# Altium schematic sheet DAC_8CH.SchDoc
size A4; DocumentNumber: 3; SheetNumber: 3; SheetTotal: 7
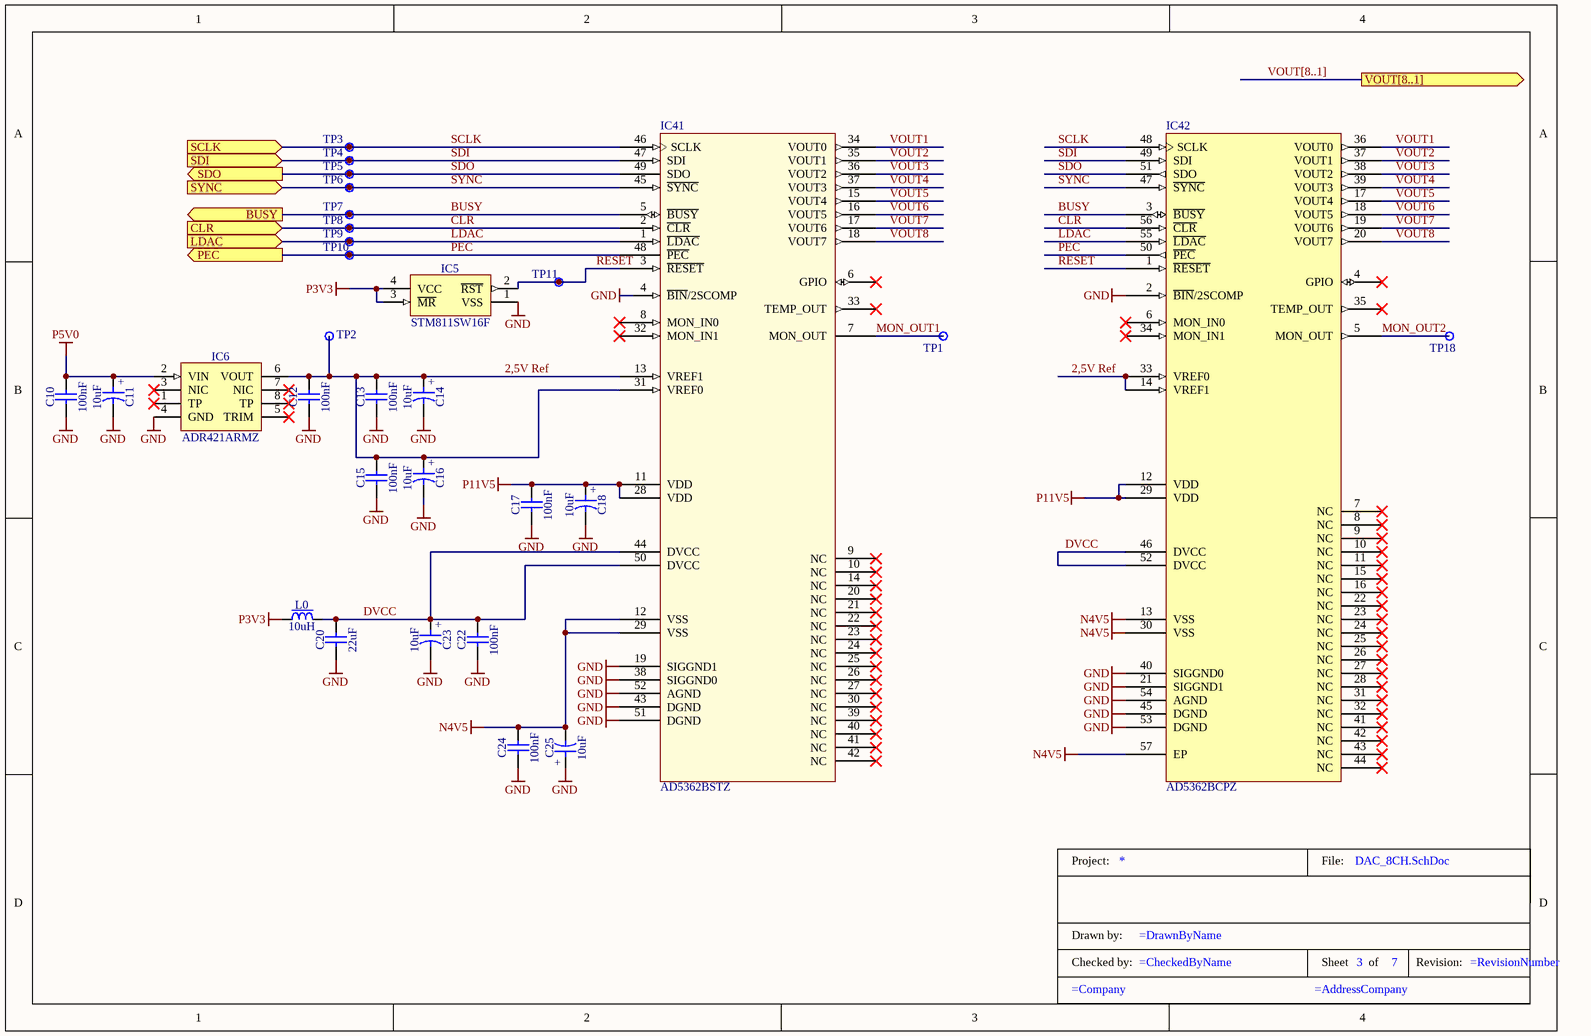
[diagram p0: DAC_8CH.SchDoc]

## Parts
C10  100nF  [CAPC1005X55N]
C11  10uF  [CAPMP3528X210N]
C12  100nF  [CAPC1005X55N]
C13  100nF  [CAPC1005X55N]
C14  10uF  [CAPMP3528X210N]
C15  100nF  [CAPC1005X55N]
C16  10uF  [CAPMP3528X210N]
C17  100nF  [CAPC1005X55N]
C18  10uF  [CAPMP3528X210N]
C20  22uF  [CAPC2012X135N]
C22  100nF  [CAPC1005X55N]
C23  10uF  [CAPMP3528X210N]
C24  100nF  [CAPC1005X55N]
C25  10uF  [CAPMP3528X210N]
IC5  STM811SW16F  [SOT143N]
IC6  ADR421ARMZ  [SOP65P490X110-8N]
IC41  AD5362BSTZ  [ST-52_N]
IC42  AD5362BCPZ  [CP-56-1_N]
L0  10uH  [IND_MURATA-PS_8400]
TitleBlock3  TitleBlock  (value not drawn)  (graphical)
TP1  Test Point  [TPS127]  (value not drawn)
TP2  Test Point  [TPS127]  (value not drawn)
TP3  Test Point  [TPS127]  (value not drawn)
TP4  Test Point  [TPS127]  (value not drawn)
TP5  Test Point  [TPS127]  (value not drawn)
TP6  Test Point  [TPS127]  (value not drawn)
TP7  Test Point  [TPS127]  (value not drawn)
TP8  Test Point  [TPS127]  (value not drawn)
TP9  Test Point  [TPS127]  (value not drawn)
TP10  Test Point  [TPS127]  (value not drawn)
TP11  Test Point  [TPS127]  (value not drawn)
TP18  Test Point  [TPS127]  (value not drawn)

## Ports
BUSY (out), CLR (in), LDAC (in), PEC (out), SCLK (in), SDI (in), SDO (out), SYNC (in), VOUT[8..1] (out)

## Nets
GND: C10.1 C11.2 C12.1 C13.1 C14.2 C15.1 C16.2 C17.1 C18.2 C20.1 C22.1 C23.2 C24.1 C25.1 IC5.1(VSS) IC6.4(GND) IC41.4(~{BIN}/2SCOMP) IC41.19(SIGGND1) IC41.38(SIGGND0) IC41.43(DGND) IC41.51(DGND) IC41.52(AGND) IC42.2(~{BIN}/2SCOMP) IC42.21(SIGGND1) IC42.40(SIGGND0) IC42.45(DGND) IC42.53(DGND) IC42.54(AGND)
N4V5: C24.2 C25.2 IC41.12(VSS) IC41.29(VSS) IC42.13(VSS) IC42.30(VSS) IC42.57(EP)
P3V3: IC5.3(~{MR}) IC5.4(VCC) L0.1
P5V0: C10.2 C11.1 IC6.2(VIN)
P11V5: C17.2 C18.1 IC41.11(VDD) IC41.28(VDD) IC42.12(VDD) IC42.29(VDD)
2,5V Ref: C12.2 C13.2 C14.1 C15.2 C16.1 IC6.6(VOUT) IC41.13(VREF1) IC41.31(VREF0) IC42.14(VREF1) IC42.33(VREF0) TP2.1
BUSY: IC41.5(~{BUSY}) IC42.3(~{BUSY}) TP7.1 ; port BUSY
CLR: IC41.2(~{CLR}) IC42.56(~{CLR}) TP8.1 ; port CLR
DVCC: C20.2 C22.2 C23.1 IC41.44(DVCC) IC41.50(DVCC) IC42.46(DVCC) IC42.52(DVCC) L0.2
LDAC: IC41.1(~{LDAC}) IC42.55(~{LDAC}) TP9.1 ; port LDAC
MON_OUT1: IC41.7(MON_OUT) TP1.1
MON_OUT2: IC42.5(MON_OUT) TP18.1
PEC: IC41.48(~{PEC}) IC42.50(~{PEC}) TP10.1 ; port PEC
~{RESET}: IC5.2(~{RST}) IC41.3(~{RESET}) IC42.1(~{RESET}) TP11.1
SCLK: IC41.46(SCLK) IC42.48(SCLK) TP3.1 ; port SCLK
SDI: IC41.47(SDI) IC42.49(SDI) TP4.1 ; port SDI
SDO: IC41.49(SDO) IC42.51(SDO) TP5.1 ; port SDO
SYNC: IC41.45(~{SYNC}) IC42.47(~{SYNC}) TP6.1 ; port SYNC
VOUT1: IC41.34(VOUT0) IC42.36(VOUT0)
VOUT2: IC41.35(VOUT1) IC42.37(VOUT1)
VOUT3: IC41.36(VOUT2) IC42.38(VOUT2)
VOUT4: IC41.37(VOUT3) IC42.39(VOUT3)
VOUT5: IC41.15(VOUT4) IC42.17(VOUT4)
VOUT6: IC41.16(VOUT5) IC42.18(VOUT5)
VOUT7: IC41.17(VOUT6) IC42.19(VOUT6)
VOUT8: IC41.18(VOUT7) IC42.20(VOUT7)

Not connected (* = marked no-connect by the designer): IC6 1(TP)* 3(NIC)* 5(TRIM)* 7(NIC)* 8(TP)*; IC41 6(GPIO)* 8(MON_IN0)* 9(NC)* 10(NC)* 14(NC)* 20(NC)* 21(NC)* 22(NC)* 23(NC)* 24(NC)* 25(NC)* 26(NC)* 27(NC)* 30(NC)* 32(MON_IN1)* 33(TEMP_OUT)* 39(NC)* 40(NC)* 41(NC)* 42(NC)*; IC42 4(GPIO)* 6(MON_IN0)* 7(NC)* 8(NC)* 9(NC)* 10(NC)* 11(NC)* 15(NC)* 16(NC)* 22(NC)* 23(NC)* 24(NC)* 25(NC)* 26(NC)* 27(NC)* 28(NC)* 31(NC)* 32(NC)* 34(MON_IN1)* 35(TEMP_OUT)* 41(NC)* 42(NC)* 43(NC)* 44(NC)*

## Buses and harness runs
bus VOUT[8..1] = port VOUT[8..1]

## Notes on the sheet
- (in symbol CTE3528-21_10UF_16V_20%_PANASONIC_TQC) +
- (in symbol TitleBlock) Project:; File:; Drawn by:; Checked by:; Sheet; of; Revision:

## Library data of the parts
C10 C12 C13 C15 C17 C22 C24 = CC0402_100NF_16V_10%_X7R: Non-polarised capacitor; Part Description: SMD Multilayer Chip Ceramic Capacitor; Manufacturer: GENERIC; Manufacturer1 Part Number: GRM155R71C104KA88D; Voltage: 16V; TC: X7R; Tolerance: ±10%; Part Number: CC0402_100NF_16V_10%_X7R; Component Kind: Standard; Component Type: Standard; Pin Count: 2; Value: 100nF; Status: Not Recommended; Manufacturer Part Number: CC0402_100NF_16V_10%_X7R; Case: 0402; Mounted: Yes; Socket: No; SMD: Yes; Sense: No; Manufacturer1 Example: MURATA; Manufacturer1 ComponentHeight: 0.55mm; HelpURL: \\cern.ch\dfs\Applications\Altium\Datasheets\CC0402_X7R_MURATA_GRM.pdf; Author: CERN DEM JLC; CreateDate: 05.12.2013; LatestRevisionDate: 03.12.2007
C11 C14 C16 C18 C23 C25 = CTE3528-21_10UF_16V_20%_PANASONIC_TQC: Polarised capacitor; Part Description: ESR 0R1 Solid Tantalum Chip Capacitor; Manufacturer Part Number: 16TQC10M; Voltage: 16V; Tolerance: ±20%; Part Number: CTE3528-21_10UF_16V_20%_PANASONIC_TQC; Component Kind: Standard; Component Type: Standard; Pin Count: 2; Value: 10uF; Status: None; Manufacturer: PANASONIC; Case: B; Mounted: Yes; Socket: No; SMD: Yes; Sense: No; ComponentHeight: 2mm; HelpURL: \\cern.ch\dfs\Applications\Altium\Datasheets\CTE_PANASONIC_TQC.pdf; Author: CERN DEM JLC; CreateDate: 01.09.2014; LatestRevisionDate: 01.09.2014
C20 = CC0805_22UF_16V_10%_X5R: Non-polarised capacitor; Part Description: SMD Multilayer Chip Ceramic Capacitor; Manufacturer: GENERIC; Manufacturer1 Part Number: C2012X5R1C226KT; Voltage: 16V; TC: X5R; Tolerance: ±10%; Part Number: CC0805_22UF_16V_10%_X5R; Component Kind: Standard; Component Type: Standard; Pin Count: 2; Value: 22uF; Status: Preferred; Manufacturer Part Number: CC0805_22UF_16V_10%_X5R; Case: 0805; Mounted: Yes; Socket: No; SMD: Yes; Sense: No; Manufacturer1 Example: TDK; Manufacturer1 ComponentHeight: 1.35mm; HelpURL: \\cern.ch\dfs\Applications\Altium\Datasheets\CC0805_X5R_TDK_C.pdf; Author: CERN DEM JLC; CreateDate: 25.10.2012; LatestRevisionDate: 25.10.2012
IC5 = STM811SW16F: Microprocessor Reset Circuit; Part Description: 2.93V Reset Threshold Voltage Microprocessor Reset Circuit; Manufacturer: ST MICROELECTRONICS; PressFit: No; Bonding: No; Part Number: STM811SW16F; Component Kind: Standard; Component Type: Standard; Device: STM811SW16F; PackageDescription: SOT143, 4-Leads, Body 3.0x2.6mm (max), Pitch 1.92mm, IPC Medium Density; Manufacturer Part Number: STM811SW16F; Pin Count: 4; Case: SOT143; Mounted: Yes; Socket: No; SMD: Yes; Sense: No; ComponentHeight: 1.12mm; Author: CERN DEM JLC; HelpURL: \\cern.ch\dfs\Applications\Altium\Datasheets\STM811SW16F.pdf; CreateDate: 17.11.2016; LatestRevisionDate: 17.11.2016
IC6 = ADR421ARMZ: Ultraprecision, Low Noise, 2.048 V/2.500 V/  3.00 V/5.00 V XFET Voltage References; Part Description: 2.5V ±3mV 10ppm, Ultraprecision, Low Noise, XFET® Voltage References; Manufacturer: ANALOG DEVICES; PressFit: No; Bonding: No; Part Number: ADR421ARMZ; Component Kind: Standard; Component Type: Standard; Device: ADR421ARMZ; PackageDescription: SOP, 0.65mm pitch; 8 pin, 3.00mm W X 3.00mm L X 1.10mm H body, IPC Medium Density; Manufacturer Part Number: ADR421ARMZ; Pin Count: 8; Case: MSOP8; Mounted: Yes; Socket: No; SMD: Yes; Sense: No; ComponentHeight: 1.1mm; HelpURL: \\cern.ch\dfs\Applications\Altium\Datasheets\ADR421ARMZ.pdf; Author: CERN DEM JLC; CreateDate: 27.10.2011; LatestRevisionDate: 27.10.2011
IC41 = AD5362BSTZ: IC, 16BIT DAC, 8CH, SERIAL, 52LFCSP; Manufacturer 1: Analog Devices; Resolution: 16b; Settling Time: 20us; Integral Nonlinearity (INL): 4LSB; Output Type: Voltage; Interface: SPI,Serial; Number of Bits: 16; Sampling Rate: 540KS/s; Number of DAC Channels: 8; Max Supply Voltage: 16.5V; Min Supply Voltage: 8V; Max Power Dissipation: 209mW; Dual Supply Voltage: 15V; Differential Output: No; Polarity: Bipolar,Unipolar; Max Input Voltage: 5V; Min Input Voltage: 2V; Max Output Voltage: 20V; Slew Rate: 1V/µs; Nominal Supply Current: 8.5mA; Supplier 1: Arrow; Manufacturer Part Number 1: AD5362BSTZ; Stock 1: 15; Pricing 1: 1=43,05000, 5=41,82000, 10=40,47990, 25=37,43000, 50=36,88000, 100=33,58000, 250=32,20000 (USD); RoHS: Yes; Case/Package: LQFP; Number of Pins: 52; Contact Plating: Tin,Matte; Min Operating Temperature: -40°C; Max Operating Temperature: 85°C; Package Quantity: 1; Packaging: Tray; Max Dual Supply Voltage: 16.5V; Number of Converters: 8; Number of D/A Converters: 8; Power Dissipation: 209mW; Min Output Voltage: 8V; Number of Channels: 8; Number of Outputs: 8; Termination: SMD/SMT; Length: 10mm; Height: 1.4mm; Width: 10mm; Radiation Hardening: No; Lead Free: Contains Lead; REACH SVHC: No SVHC; ComponentLink1URL: https://datasheet.ciiva.com/1145/1789185-1145089.pdf?src-supplier=Avnet; ComponentLink1Description: https://datasheet.ciiva.com/1145/1789185-1145089.pdf?src-supplier=Avnet; ComponentLink2URL: https://datasheet.ciiva.com/1145/1789185-1145089.pdf?src-supplier=Farnell; ComponentLink2Description: https://datasheet.ciiva.com/1145/1789185-1145089.pdf?src-supplier=Farnell; ComponentLink3URL: https://datasheet.ciiva.com/26802/ad5362bstz-26802160.pdf?src-supplier=IIIC; ComponentLink3Description: https://datasheet.ciiva.com/26802/ad5362bstz-26802160.pdf?src-supplier=IIIC; ComponentLink4URL: https://datasheet.ciiva.com/1142/ad5362-5363-1142361.pdf?src-supplier=Element14; ComponentLink4Description: https://datasheet.ciiva.com/1142/ad5362-5363-1142361.pdf?src-supplier=Element14; ComponentLink5URL: https://datasheet.ciiva.com/1368/ad5362-5363-1368393.pdf?src-supplier=Digi-Key; ComponentLink5Description: https://datasheet.ciiva.com/1368/ad5362-5363-1368393.pdf?src-supplier=Digi-Key; ComponentLink6URL: https://datasheet.ciiva.com/8067/ad5362-5363-8067722.pdf?src-supplier=Element14; ComponentLink6Description: https://datasheet.ciiva.com/8067/ad5362-5363-8067722.pdf?src-supplier=Element14; ComponentLink7URL: https://datasheet.ciiva.com/15146/getdatasheetpartid-64274-15146331.pdf?src-supplier=Verical; ComponentLink7Description: https://datasheet.ciiva.com/15146/getdatasheetpartid-64274-15146331.pdf?src-supplier=Verical; ComponentLink8URL: https://datasheet.ciiva.com/16598/ad5362-5363-16598797.pdf?src-supplier=Avnet+Europe; ComponentLink8Description: https://datasheet.ciiva.com/16598/ad5362-5363-16598797.pdf?src-supplier=Avnet+Europe; Supplier Part Number 1: AD5362BSTZ
IC42 = AD5362BCPZ: DAC 8-CH Resistor-String 16-bit 56-Pin LFCSP EP Tray; Manufacturer 1: Analog Devices; Settling Time: 20us; Resolution: 16b; Interface: SPI,Serial; Number of Bits: 16; Output Type: Voltage; Integral Nonlinearity (INL): 4LSB; Number of Converters: 8; Sampling Rate: 540KS/s; Max Supply Voltage: 16.5V; Min Supply Voltage: 8V; Differential Output: No; Polarity: Bipolar,Unipolar; Max Power Dissipation: 209mW; Max Input Voltage: 5V; Min Input Voltage: 2V; Max Output Voltage: 20V; Dual Supply Voltage: 15V; Slew Rate: 1V/µs; Supplier 1: Digi-Key; Manufacturer Part Number 1: AD5362BCPZ; Stock 1: 39; Pricing 1: 1=45,65000, 10=42,58500, 25=40,80000, 100=35,70000 (USD); RoHS: Yes; Case/Package: LFCSP EP; Number of Pins: 56; Contact Plating: Tin,Matte; Min Operating Temperature: -40°C; Max Operating Temperature: 85°C; Package Quantity: 260; Packaging: Tray; Number of Channels: 8; Min Output Voltage: 8V; Number of DAC Channels: 8; Number of D/A Converters: 8; Power Dissipation: 209mW; Max Dual Supply Voltage: 16.5V; Conversion Rate: 540KS/s; Length: 8mm; Height: 1mm; Width: 8mm; Radiation Hardening: No; Lead Free: Contains Lead; REACH SVHC: No SVHC; ComponentLink1URL: https://datasheet.ciiva.com/26904/getdatasheetpartid-564152-26904872.pdf?src-supplier=Verical; ComponentLink1Description: https://datasheet.ciiva.com/26904/getdatasheetpartid-564152-26904872.pdf?src-supplier=Verical; ComponentLink2URL: https://datasheet.ciiva.com/25624/0900766b810b9edf-25624053.pdf?src-supplier=RSComponents; ComponentLink2Description: https://datasheet.ciiva.com/25624/0900766b810b9edf-25624053.pdf?src-supplier=RSComponents; ComponentLink3URL: https://datasheet.ciiva.com/26802/ad5362bcpz-26802158.pdf?src-supplier=IIIC; ComponentLink3Description: https://datasheet.ciiva.com/26802/ad5362bcpz-26802158.pdf?src-supplier=IIIC; ComponentLink4URL: https://datasheet.ciiva.com/1142/1789185-1142360.pdf?src-supplier=Element14; ComponentLink4Description: https://datasheet.ciiva.com/1142/1789185-1142360.pdf?src-supplier=Element14; ComponentLink5URL: https://datasheet.ciiva.com/3040/ad5362-5363-3040735.pdf?src-supplier=Avnet; ComponentLink5Description: https://datasheet.ciiva.com/3040/ad5362-5363-3040735.pdf?src-supplier=Avnet; ComponentLink6URL: https://datasheet.ciiva.com/16598/ad5362-5363-16598793.pdf?src-supplier=Avnet+Europe; ComponentLink6Description: https://datasheet.ciiva.com/16598/ad5362-5363-16598793.pdf?src-supplier=Avnet+Europe; ComponentLink7URL: https://datasheet.ciiva.com/1368/ad5362-5363-1368394.pdf?src-supplier=Digi-Key; ComponentLink7Description: https://datasheet.ciiva.com/1368/ad5362-5363-1368394.pdf?src-supplier=Digi-Key; Supplier Part Number 1: AD5362BCPZ-ND
L0 = IND_10UH_10%_MURATA-PS_8400: Inductor With Core; Part Description: Miniature Surface Mount Power Inductor (8400 Series); Manufacturer: MURATA POWER SOLUTIONS; Manufacturer Part Number: 84103C; Power: 950mA; Resistance: 0.24R; Tolerance: ±10%; Part Number: IND_10UH_10%_MURATA-PS_8400; Component Kind: Standard; Component Type: Standard; Pin Count: 2; Value: 10uH; Status: None; Mounted: Yes; Socket: No; SMD: Yes; Sense: No; ComponentHeight: 2.9mm; HelpURL: \\cern.ch\dfs\Applications\Altium\Datasheets\IND_MURATA-PS_8400.pdf; Author: CERN DEM JLC; CreateDate: 02.07.2012; LatestRevisionDate: 02.07.2012
TP1-TP11 TP18 = SMD_PAD_1.27X1.27MM: Part Description: 1.27mm x 1.27mm PCB Copper Area (SMD Test Point); Mounted: No; Part Number: SMD_PAD_1.27X1.27MM; Component Kind: Standard (No BOM); Component Type: Standard (No BOM); Pin Count: 1; Family: Test Point; Socket: No; SMD: Yes; Sense: No; Status: None; ComponentHeight: 0mm; HelpURL: Undefined; Author: CERN DEM JLC; CreateDate: 12.01.2008; LatestRevisionDate: 12.01.2008; PackageDescription: 1.27mm x 1.27mm PCB Copper Area (SMD Test Point)